# Altium schematic sheet Top.SchDoc
size A4
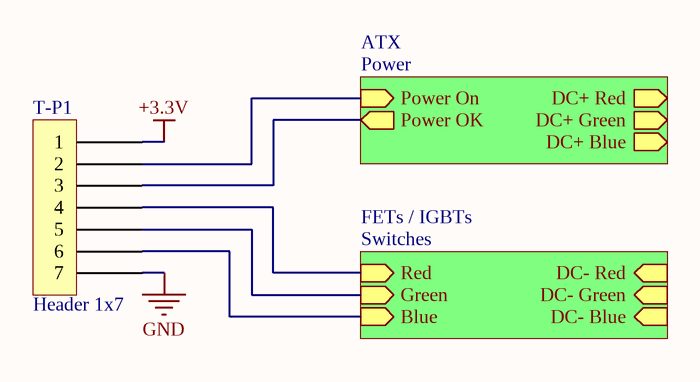
[diagram p0: Top.SchDoc]

## Parts
T-P1  Header 1x7  [Header 1x7]

## Sub-sheets
ATX = Power: Power On (in), Power OK (out), DC+ Red (out), DC+ Green (out), DC+ Blue (out)
FETs / IGBTs = Switches: Red (in), Green (in), Blue (in), DC- Red (in), DC- Green (in), DC- Blue (in)

## Nets
+3.3V: T-P1.1
GND: T-P1.7
NetT-P1_2: T-P1.2 ; sheet ATX/Power On
NetT-P1_3: T-P1.3 ; sheet ATX/Power OK
NetT-P1_4: T-P1.4 ; sheet FETs / IGBTs/Red
NetT-P1_5: T-P1.5 ; sheet FETs / IGBTs/Green
NetT-P1_6: T-P1.6 ; sheet FETs / IGBTs/Blue